# Altium schematic sheet UART_schem.SchDoc
size A
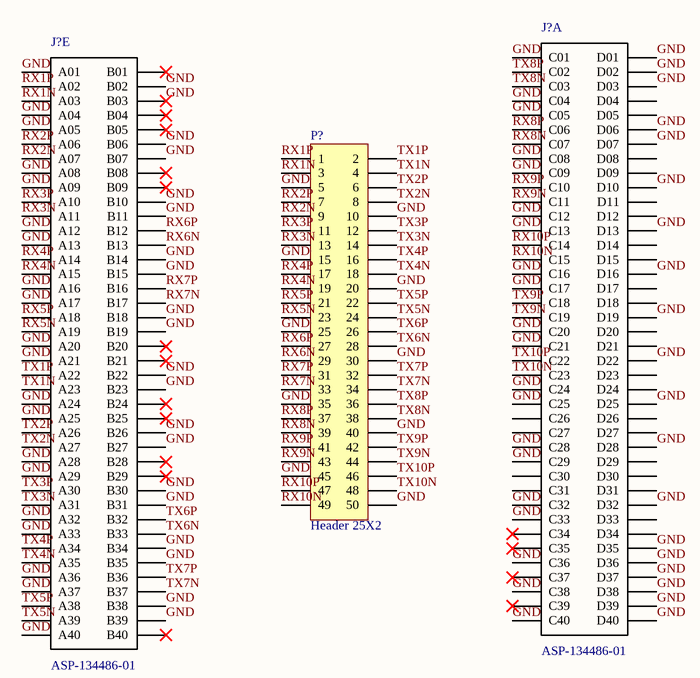
[diagram p0: UART_schem.SchDoc]

## Parts
(Parts that share a designator on the sheet are numbered #1, #2 ... from top to bottom, then left to right.)
J?#1  ASP-134486-01  [*SAMTEC_ASP-134486-01_ASP-134486-01(Primary)]  (part A of 5)
J?#2  ASP-134486-01  [*SAMTEC_ASP-134486-01_ASP-134486-01(Primary)]  (part E of 5)
P?  Header 25X2  [HDR2X25]

## Nets
GND: J?#1.C1(C01) J?#1.C4(C04) J?#1.C5(C05) J?#1.C8(C08) J?#1.C9(C09) J?#1.C12 J?#1.C13 J?#1.C16 J?#1.C17 J?#1.C20 J?#1.C21 J?#1.C24 J?#1.C25 J?#1.C28 J?#1.C29 J?#1.C32 J?#1.C33 J?#1.C36 J?#1.C38 J?#1.C40 J?#1.D1(D01) J?#1.D2(D02) J?#1.D3(D03) J?#1.D6(D06) J?#1.D7(D07) J?#1.D10 J?#1.D13 J?#1.D16 J?#1.D19 J?#1.D22 J?#1.D25 J?#1.D28 J?#1.D32 J?#1.D35 J?#1.D36 J?#1.D37 J?#1.D38 J?#1.D39 J?#1.D40 J?#2.A1(A01) J?#2.A4(A04) J?#2.A5(A05) J?#2.A8(A08) J?#2.A9(A09) J?#2.A12 J?#2.A13 J?#2.A16 J?#2.A17 J?#2.A20 J?#2.A21 J?#2.A24 J?#2.A25 J?#2.A28 J?#2.A29 J?#2.A32 J?#2.A33 J?#2.A36 J?#2.A37 J?#2.A40 J?#2.B2(B02) J?#2.B3(B03) J?#2.B6(B06) J?#2.B7(B07) J?#2.B10 J?#2.B11 J?#2.B14 J?#2.B15 J?#2.B18 J?#2.B19 J?#2.B22 J?#2.B23 J?#2.B26 J?#2.B27 J?#2.B30 J?#2.B31 J?#2.B34 J?#2.B35 J?#2.B38 J?#2.B39 P?.5 P?.10 P?.15 P?.20 P?.25 P?.30 P?.35 P?.40 P?.45 P?.50
RX1N: J?#2.A3(A03) P?.3
RX1P: J?#2.A2(A02) P?.1
RX2N: J?#2.A7(A07) P?.9
RX2P: J?#2.A6(A06) P?.7
RX3N: J?#2.A11 P?.13
RX3P: J?#2.A10 P?.11
RX4N: J?#2.A15 P?.19
RX4P: J?#2.A14 P?.17
RX5N: J?#2.A19 P?.23
RX5P: J?#2.A18 P?.21
RX6N: J?#2.B13 P?.29
RX6P: J?#2.B12 P?.27
RX7N: J?#2.B17 P?.33
RX7P: J?#2.B16 P?.31
RX8N: J?#1.C7(C07) P?.39
RX8P: J?#1.C6(C06) P?.37
RX9N: J?#1.C11 P?.43
RX9P: J?#1.C10 P?.41
RX10N: J?#1.C15 P?.49
RX10P: J?#1.C14 P?.47
TX1N: J?#2.A23 P?.4
TX1P: J?#2.A22 P?.2
TX2N: J?#2.A27 P?.8
TX2P: J?#2.A26 P?.6
TX3N: J?#2.A31 P?.14
TX3P: J?#2.A30 P?.12
TX4N: J?#2.A35 P?.18
TX4P: J?#2.A34 P?.16
TX5N: J?#2.A39 P?.24
TX5P: J?#2.A38 P?.22
TX6N: J?#2.B33 P?.28
TX6P: J?#2.B32 P?.26
TX7N: J?#2.B37 P?.34
TX7P: J?#2.B36 P?.32
TX8N: J?#1.C3(C03) P?.38
TX8P: J?#1.C2(C02) P?.36
TX9N: J?#1.C19 P?.44
TX9P: J?#1.C18 P?.42
TX10N: J?#1.C23 P?.48
TX10P: J?#1.C22 P?.46

Not connected (* = marked no-connect by the designer): J?#1 C26 C27 C30 C31 C34* C35* C37* C39* D4(D04) D5(D05) D8(D08) D9(D09) D11 D12 D14 D15 D17 D18 D20 D21 D23 D24 D26 D27 D29 D30 D31 D33 D34; J?#2 B1(B01)* B4(B04)* B5(B05)* B8(B08)* B9(B09)* B20* B21* B24* B25* B28* B29* B40*

## Library data of the parts
J?#1 J?#2 = ASP-134486-01: 400 Position Connector Array, Female Sockets Surface Mount Gold; MF: Samtec Inc.; MP: ASP-134486-01; Digi-Key_Purchase_URL: https://www.digikey.com/product-detail/en/samtec-inc/ASP-134486-01/SAM8728CT-ND/2135095?utm_source=snapeda&utm_medium=aggregator&utm_campaign=symbol; SnapEDA_Link: https://www.snapeda.com/parts/ASP-134486-01/Samtec%20Inc./view-part/898249/?ref=snap; Package: None; Digi-Key_Part_Number: SAM8728CT-ND; Value: *
P? = Header 25X2: Header, 25-Pin, Dual row; LatestRevisionDate: 17-Jul-2002; LatestRevisionNote: Re-released for DXP Platform.; Publisher: Altium Limited